# EasyEDA Pro project 多功能拓展板.eprj

# Schematic Schematic1
Create Date: 2024-04-21; Page Name: P1; Project Name: 多功能拓展板; Schematic Name: Schematic1; Update Date: 2024-04-21; Company: 嘉立创EDA; Page Size: A3; Version: V1.0
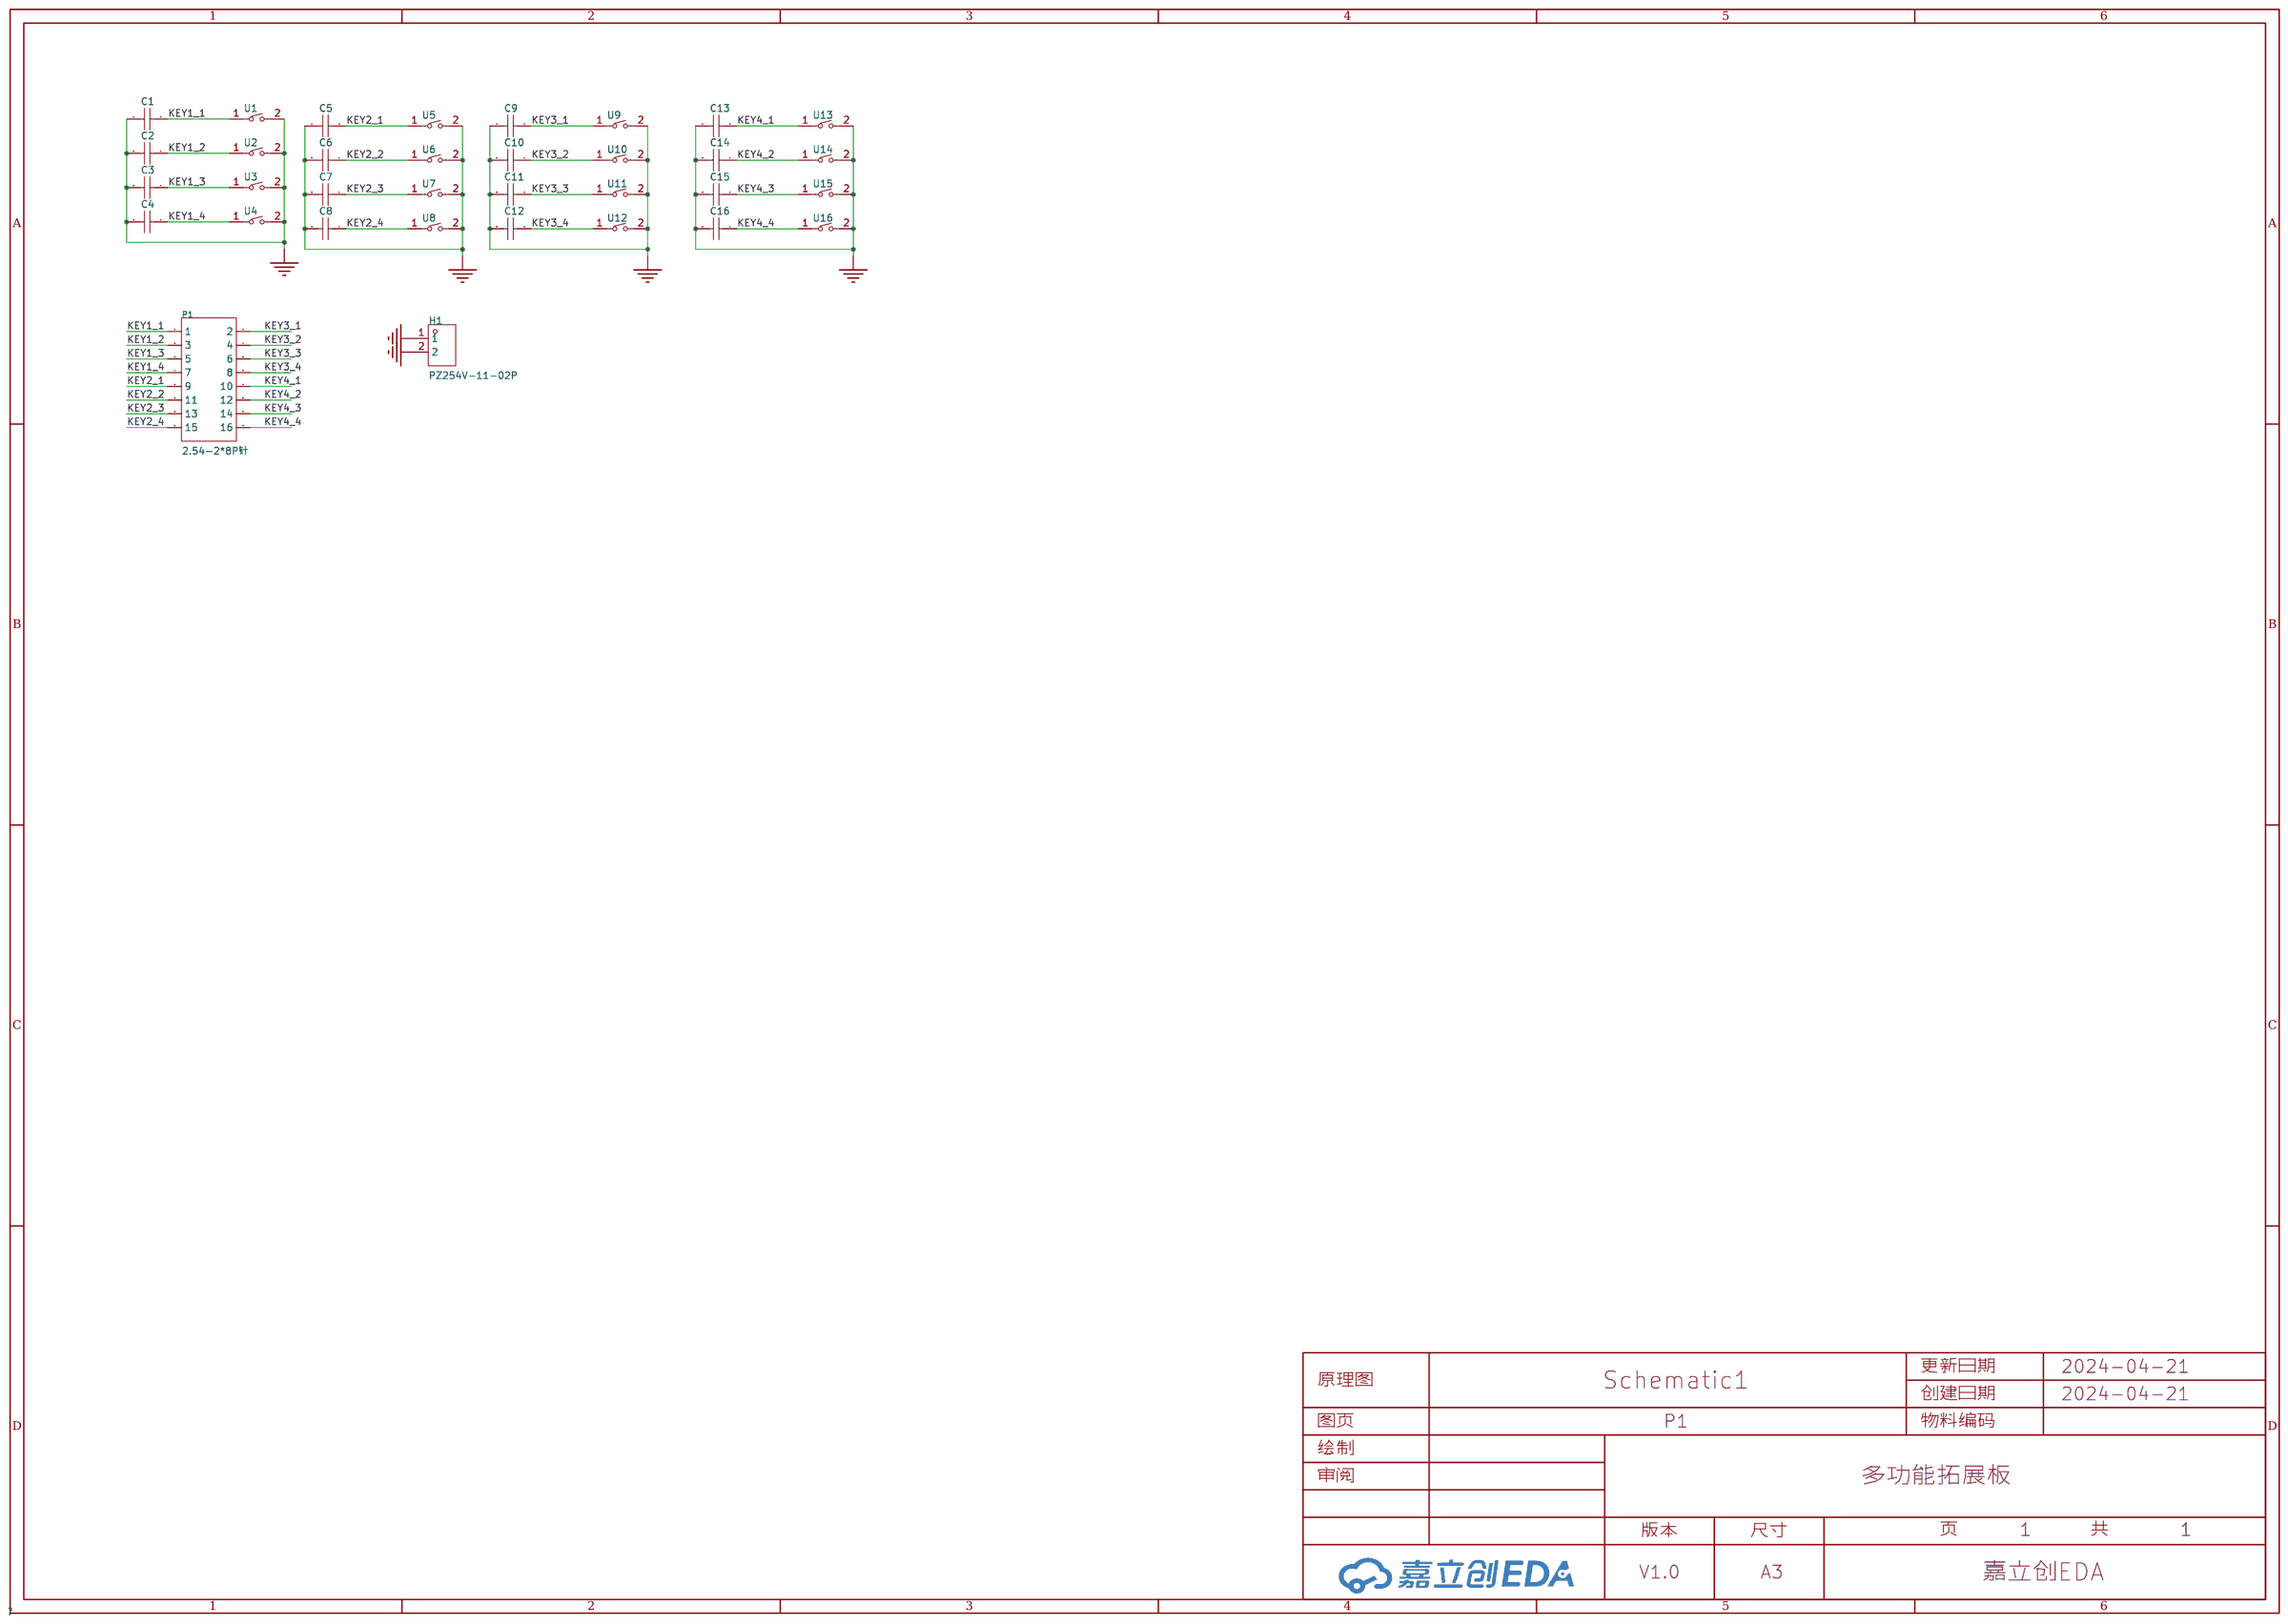
[diagram p0: schematic sheet]

## Parts
C1  100nF  [C0805]
C2  100nF  [C0805]
C3  100nF  [C0805]
C4  100nF  [C0805]
C5  100nF  [C0805]
C6  100nF  [C0805]
C7  100nF  [C0805]
C8  100nF  [C0805]
C9  100nF  [C0805]
C10  100nF  [C0805]
C11  100nF  [C0805]
C12  100nF  [C0805]
C13  100nF  [C0805]
C14  100nF  [C0805]
C15  100nF  [C0805]
C16  100nF  [C0805]
H1  PZ254V-11-02P  [HDR-TH_2P-P2.54-V-M]
P1  2.54-2*8P针  [HDR-TH_16P-P2.54-V-M-R2-C8-S2.54]
U1  ZX-QC36-4.3CJ  [KEY-TH_L6.0-W3.5-P6.50]
U2  ZX-QC36-4.3CJ  [KEY-TH_L6.0-W3.5-P6.50]
U3  ZX-QC36-4.3CJ  [KEY-TH_L6.0-W3.5-P6.50]
U4  ZX-QC36-4.3CJ  [KEY-TH_L6.0-W3.5-P6.50]
U5  ZX-QC36-4.3CJ  [KEY-TH_L6.0-W3.5-P6.50]
U6  ZX-QC36-4.3CJ  [KEY-TH_L6.0-W3.5-P6.50]
U7  ZX-QC36-4.3CJ  [KEY-TH_L6.0-W3.5-P6.50]
U8  ZX-QC36-4.3CJ  [KEY-TH_L6.0-W3.5-P6.50]
U9  ZX-QC36-4.3CJ  [KEY-TH_L6.0-W3.5-P6.50]
U10  ZX-QC36-4.3CJ  [KEY-TH_L6.0-W3.5-P6.50]
U11  ZX-QC36-4.3CJ  [KEY-TH_L6.0-W3.5-P6.50]
U12  ZX-QC36-4.3CJ  [KEY-TH_L6.0-W3.5-P6.50]
U13  ZX-QC36-4.3CJ  [KEY-TH_L6.0-W3.5-P6.50]
U14  ZX-QC36-4.3CJ  [KEY-TH_L6.0-W3.5-P6.50]
U15  ZX-QC36-4.3CJ  [KEY-TH_L6.0-W3.5-P6.50]
U16  ZX-QC36-4.3CJ  [KEY-TH_L6.0-W3.5-P6.50]

## Library data of the parts
C1-C16 = 0805B104K500NT: 容值:100nF;精度:±10%;额定电压:50V;材质(温度系数):X7R;; LCSC Part Name: 100nF ±10% 50V; Supplier Part: C38141; Manufacturer: FH(风华); Supplier Footprint: 0805; JLCPCB Part Class: 扩展库; Datasheet: https://atta.szlcsc.com/upload/public/pdf/source/20200305/C486355_26A10D38EF8C2A5C37091D0039909270.pdf; Supplier: LCSC; Tolerance: ±10%; Voltage Rated: 50V; Temperature Coefficient: X7R
H1 = PZ254V-11-02P: 插针结构:1x2P;间距:2.54mm;行距:-;圆针/方针:方针;安装类型:直插;排数:单排;总PIN位数:2P;额定电流:-;额定电压:-;配合针长度:6mm;塑高:2.5mm;端接针长度:3mm;触头材质:黄铜;触头镀层:-;工作温度范围:-40℃~+105℃;颜色:黑色;; LCSC Part Name: 间距:2.54mm 1x2P 直插 方针; Supplier Part: C492401; Manufacturer: XFCN(兴飞); Supplier Footprint: 插件,P=2.54mm; JLCPCB Part Class: Extended Part; Datasheet: https://atta.szlcsc.com/upload/public/pdf/source/20200309/C492401_A812433581A9B211A7FFA413ADDFF0E5.pdf; Supplier: LCSC; Pin Structure: 1x2P; Pitch: 2.54mm; Circluar Pins/Square Pins: 方针; Mounting Type: 直插; Number of Rows: 单排; Number of Pins: 2P; Length of Mating Pin: 6mm; Insulation Height: 2.5mm; Length of End Connection Pin: 3mm; Contact Material: 黄铜; Operating Temperature Range: -40℃~+105℃; Color: 黑色
P1 = 2.54-2*8P针_C68234: 插针结构:2x8P;间距:2.54mm;行距:2.54mm;圆针/方针:方针;安装类型:直插;排数:双排;总PIN位数:16P;额定电流:-;额定电压:-;配合针长度:5.9mm;塑高:2.54mm;端接针长度:-;触头材质:-;触头镀层:-;工作温度范围:-;焊接温度(最大值):-;颜色:黑色;; LCSC Part Name: 间距:2.54mm 2x8P 直插 方针; Supplier Part: C68234; Manufacturer: BOOMELE(博穆精密); Supplier Footprint: 插件,P=2.54mm; JLCPCB Part Class: 扩展库; Datasheet: https://atta.szlcsc.com/upload/public/pdf/source/20221201/C605E3BE9C0F7226363017EFD1BDE852.pdf; Supplier: LCSC; Pin Structure: 2x8P; Pitch: 2.54mm; Row Spacing: 2.54mm; Circluar Pins/Square Pins: 方针; Mounting Type: 直插; Number of Rows: 双排; Number of Pins: 16P; Length of Mating Pin: 5.9mm; Insulation Height: 2.54mm; Color: 黑色
U1 = ZX-QC36-4.3CJ: 电路结构:单刀单掷;按钮形状:矩形按钮;作用力:260gf;安装方式:直插;开关长度:3mm;开关宽度:6mm;开关高度:4.3mm;带支架:不带;触点电流:50mA;额定电压(AC):250V;额定电压(DC):12V;绝缘电阻:100MΩ;机械寿命:10万次;; LCSC Part Name: _; Supplier Part: C7470223; Manufacturer: Megastar(兆星); Supplier Footprint: DIP; JLCPCB Part Class: 扩展库; Datasheet: https://atta.szlcsc.com/upload/public/pdf/source/20230724/E786959C53B2405F67FB2C8E5CC6989E.pdf; Supplier: LCSC; Circuit: 单刀单掷; Actuator Style: 矩形按钮; Operating Force: 260gf; Mounting Style: 直插; Switch Length: 3mm; Switch Width: 6mm; Switch Height: 4.3mm; Strike Gundam: 不带; Contact Current: 50mA; Voltage Rating (AC): 250V; Voltage Rating (DC): 12V; Insulation Resistance: 100MΩ; Actuator/Cap Color: 白色; Pin Style: PC引脚; Mechanical Life: 10万次; Operating Temperature: -30℃~+80℃
U2-U16 = ZX-QC36-4.3CJ: 电路结构:单刀单掷;按钮形状:矩形按钮;作用力:260gf;安装方式:直插;开关长度:3mm;开关宽度:6mm;开关高度:4.3mm;带支架:不带;触点电流:50mA;额定电压(AC):250V;额定电压(DC):12V;绝缘电阻:100MΩ;机械寿命:10万次;; LCSC Part Name: 3*6*4.3插件开关; Supplier Part: C7470223; Manufacturer: Megastar(兆星); Supplier Footprint: DIP; JLCPCB Part Class: 扩展库; Datasheet: https://atta.szlcsc.com/upload/public/pdf/source/20230724/E786959C53B2405F67FB2C8E5CC6989E.pdf; Supplier: LCSC; Circuit: 单刀单掷; Actuator Style: 矩形按钮; Operating Force: 260gf; Mounting Style: 直插; Switch Length: 3mm; Switch Width: 6mm; Switch Height: 4.3mm; Strike Gundam: 不带; Contact Current: 50mA; Voltage Rating (AC): 250V; Voltage Rating (DC): 12V; Insulation Resistance: 100MΩ; Actuator/Cap Color: 白色; Pin Style: PC引脚; Mechanical Life: 10万次; Operating Temperature: -30℃~+80℃

## Nets
GND: C1.1 C2.2 C3.2 C4.2 C5.1 C6.2 C7.2 C8.2 C9.1 C10.2 C11.2 C12.2 C13.1 C14.2 C15.2 C16.2 H1.1 H1.2 U1.2 U2.2 U3.2 U4.2 U5.2 U6.2 U7.2 U8.2 U9.2 U10.2 U11.2 U12.2 U13.2 U14.2 U15.2 U16.2
KEY1_1: C1.2 P1.1 U1.1
KEY1_2: C2.1 P1.3 U2.1
KEY1_3: C3.1 P1.5 U3.1
KEY1_4: C4.1 P1.7 U4.1
KEY2_1: C5.2 P1.9 U5.1
KEY2_2: C6.1 P1.11 U6.1
KEY2_3: C7.1 P1.13 U7.1
KEY2_4: C8.1 P1.15 U8.1
KEY3_1: C9.2 P1.2 U9.1
KEY3_2: C10.1 P1.4 U10.1
KEY3_3: C11.1 P1.6 U11.1
KEY3_4: C12.1 P1.8 U12.1
KEY4_1: C13.2 P1.10 U13.1
KEY4_2: C14.1 P1.12 U14.1
KEY4_3: C15.1 P1.14 U15.1
KEY4_4: C16.1 P1.16 U16.1

# Board PCB1
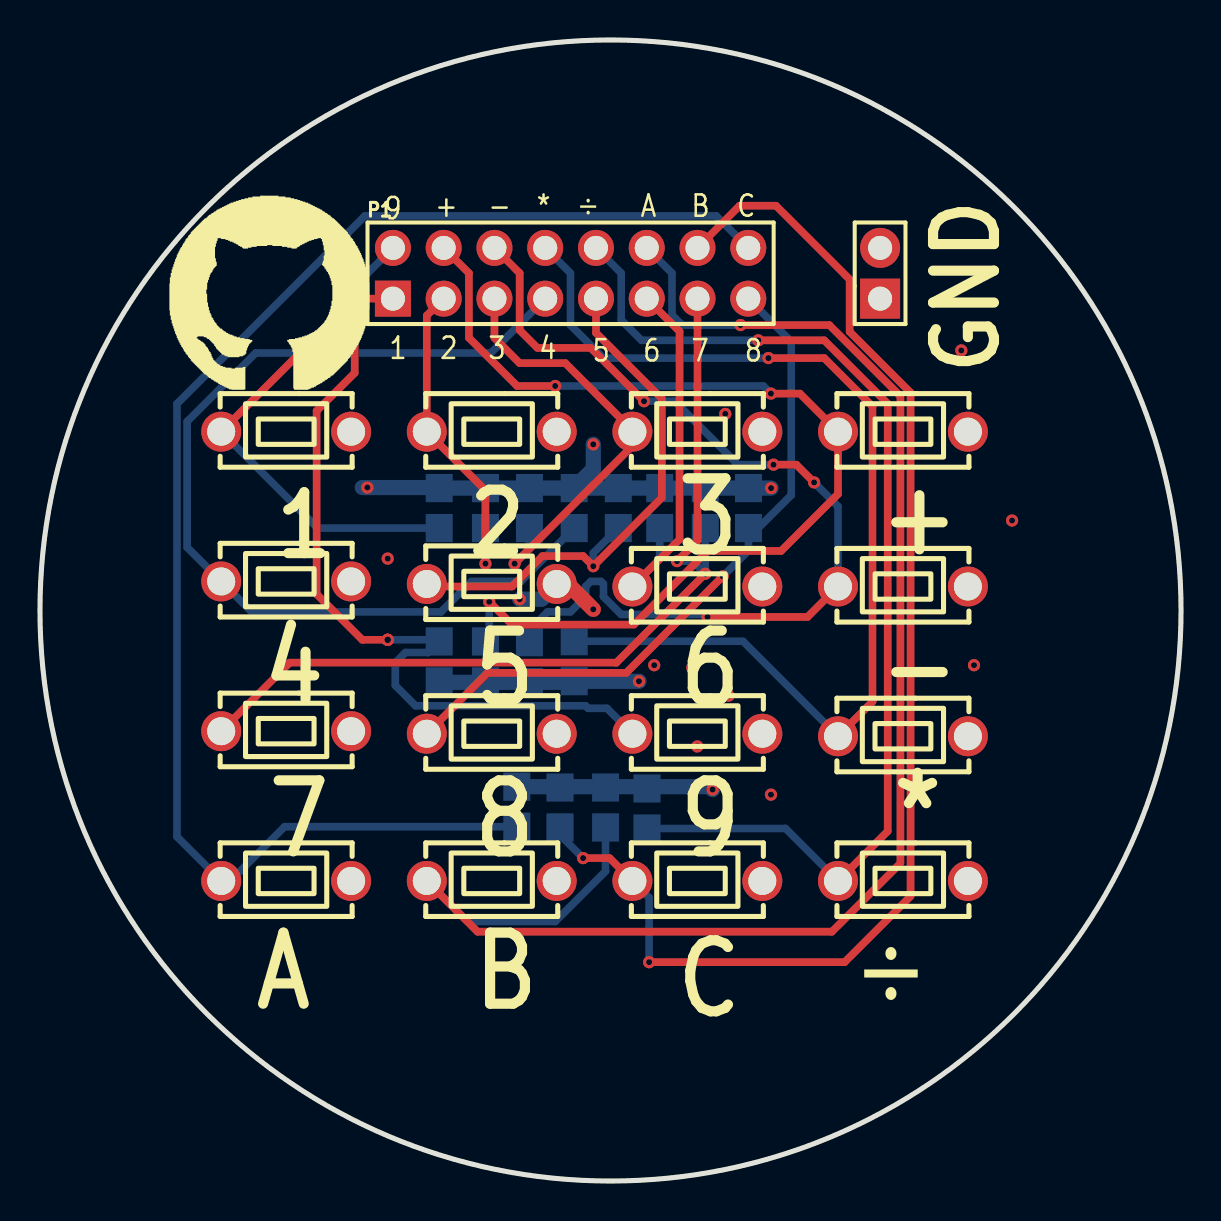
[diagram p1: board, top side]
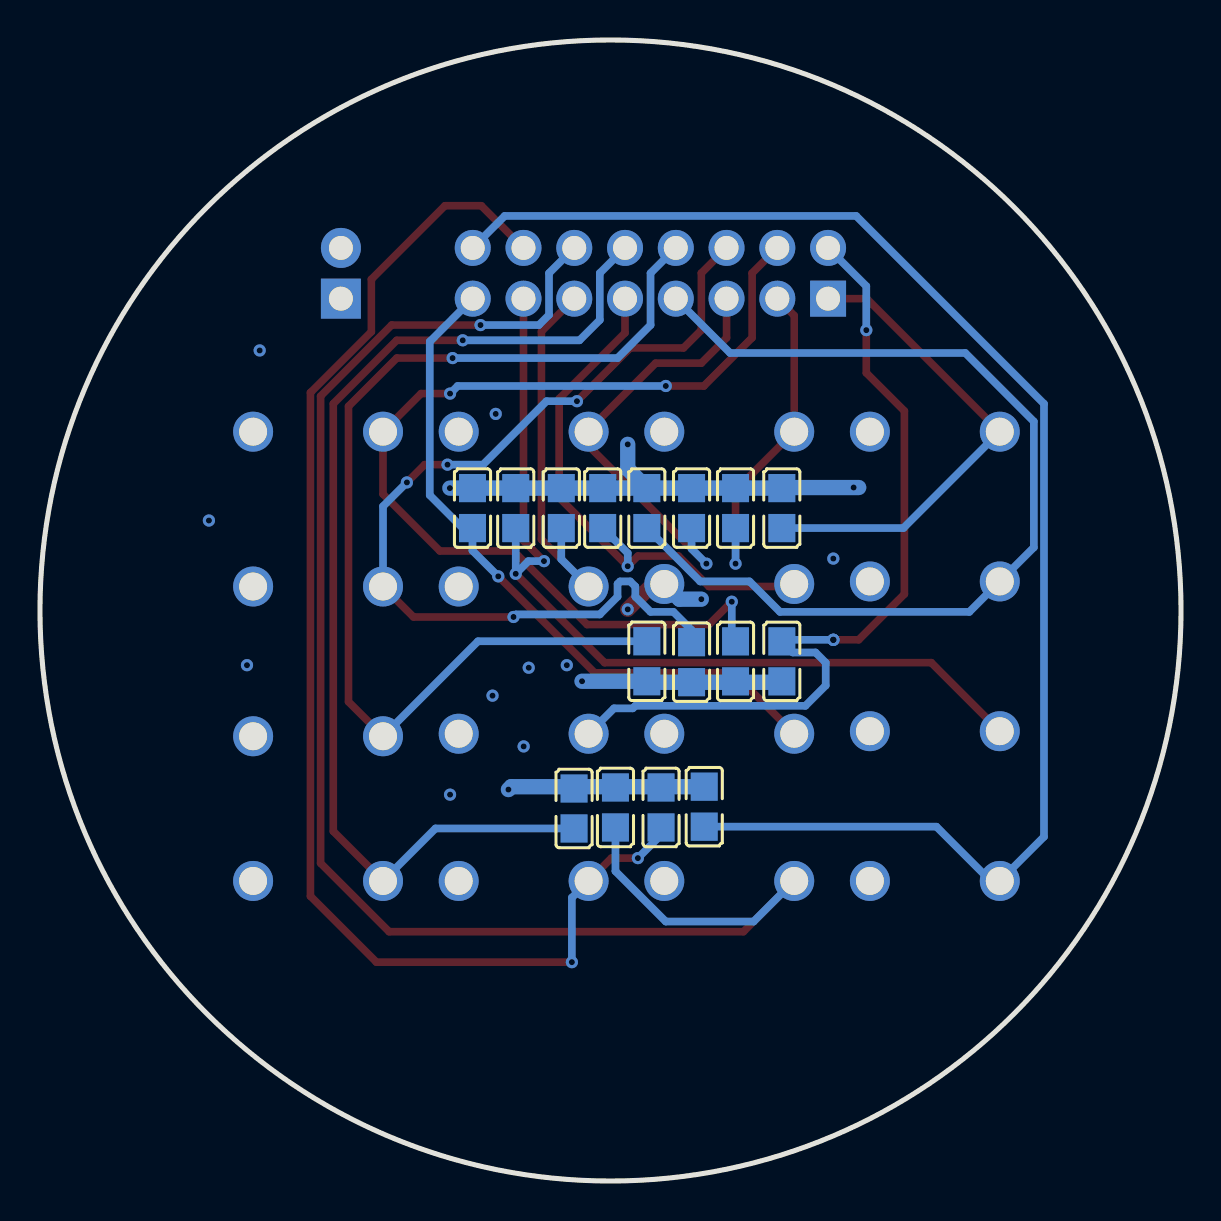
[diagram p2: board, bottom side, seen from below]

Outline 57.09 x 57.09 mm; copper layers: Top Layer, Bottom Layer. Coordinates in mm from the lower left corner of the outline.
Outline path: circle c28.55,28.55 r28.55
Stack: Top Layer 0.035mm / Dielectric1 1.51mm FR4 er 4.5 / Bottom Layer 0.035mm

## Design rules (mm)
template: 自定义配置
spacing copperThickness1oz (default): track to track 0.102, other pairs 0.152 to 0.3
spacing copperThickness2oz: track to track 0.203, other pairs 0.152 to 0.3
track width copperThickness1oz (default): min 0.127, default 0.254, max 2.54
track width copperThickness2oz: min 0.203, default 0.254, max 2.54
differential pair differentialPair (default): width min 0.127, default 0.254, max 2.54; gap min 0.152, default 0.152
via viaSize (default): diameter min 0.5, default 0.61, max 10; hole min 0.3, default 0.305, max 6.3

## Placement (name value [footprint] x y rotation side)
1  ZX-QC36-4.3CJ  [KEY-TH_L6.0-W3.5-P6.50]  12.32 37.49 0 top
2  ZX-QC36-4.3CJ  [KEY-TH_L6.0-W3.5-P6.50]  22.6 37.49 0 top
C1  100nF  [C0805]  19.97 33.67 270 bottom
C2  100nF  [C0805]  22.29 33.67 90 bottom
C3  100nF  [C0805]  24.49 33.67 90 bottom
C4  100nF  [C0805]  26.73 33.67 90 bottom
C5  100nF  [C0805]  28.94 33.67 270 bottom
C6  100nF  [C0805]  31.01 33.67 90 bottom
C7  100nF  [C0805]  33.29 33.67 90 bottom
C8  100nF  [C0805]  35.45 33.67 90 bottom
C9  100nF  [C0805]  19.97 26 90 bottom
C10  100nF  [C0805]  22.29 26 270 bottom
C11  100nF  [C0805]  24.49 25.96 270 bottom
C12  100nF  [C0805]  26.73 26.01 270 bottom
C13  100nF  [C0805]  30.37 18.64 270 bottom
C14  100nF  [C0805]  28.3 18.69 90 bottom
C15  100nF  [C0805]  26.02 18.69 90 bottom
C16  100nF  [C0805]  23.86 18.73 90 bottom
GND  PZ254V-11-02P  [HDR-TH_2P-P2.54-V-M]  42.04 45.42 90 top
P1  2.54-2*8P针  [HDR-TH_16P-P2.54-V-M-R2-C8-S2.54]  26.55 45.42 0 top
U3  ZX-QC36-4.3CJ  [KEY-TH_L6.0-W3.5-P6.50]  32.89 37.49 0 top
U4  ZX-QC36-4.3CJ  [KEY-TH_L6.0-W3.5-P6.50]  12.32 30 0 top
U5  ZX-QC36-4.3CJ  [KEY-TH_L6.0-W3.5-P6.50]  22.6 29.87 0 top
U6  ZX-QC36-4.3CJ  [KEY-TH_L6.0-W3.5-P6.50]  32.89 29.75 0 top
U7  ZX-QC36-4.3CJ  [KEY-TH_L6.0-W3.5-P6.50]  12.32 22.51 0 top
U8  ZX-QC36-4.3CJ  [KEY-TH_L6.0-W3.5-P6.50]  22.6 22.38 0 top
U9  ZX-QC36-4.3CJ  [KEY-TH_L6.0-W3.5-P6.50]  32.89 22.38 0 top
U10  ZX-QC36-4.3CJ  [KEY-TH_L6.0-W3.5-P6.50]  43.18 37.49 0 top
U11  ZX-QC36-4.3CJ  [KEY-TH_L6.0-W3.5-P6.50]  43.18 29.75 0 top
U12  ZX-QC36-4.3CJ  [KEY-TH_L6.0-W3.5-P6.50]  43.18 22.25 0 top
U13  ZX-QC36-4.3CJ  [KEY-TH_L6.0-W3.5-P6.50]  43.18 15.02 0 top
U14  ZX-QC36-4.3CJ  [KEY-TH_L6.0-W3.5-P6.50]  22.6 15.02 0 top
U15  ZX-QC36-4.3CJ  [KEY-TH_L6.0-W3.5-P6.50]  32.89 15.02 0 top
U16  ZX-QC36-4.3CJ  [KEY-TH_L6.0-W3.5-P6.50]  12.32 15.02 0 top

## Footprints (pads in the part's own frame, mm; a bottom-side part is the same pattern mirrored in y, then rotated)
C0805
  rect 1.41x1.35 smd: 1(-1,0) 2(1,0)
HDR-TH_2P-P2.54-V-M
  rect 2x2 hole 1.2: 1(-1.27,0)
  round 2 hole 1.2: 2(1.27,0)
HDR-TH_16P-P2.54-V-M-R2-C8-S2.54
  rect 1.8x1.8 hole 1.2: 1(-8.89,-1.27)
  round 1.8 hole 1.2: 2(-8.89,1.27) 3(-6.35,-1.27) 4(-6.35,1.27) 5(-3.81,-1.27) 6(-3.81,1.27) 7(-1.27,-1.27) 8(-1.27,1.27) 9(1.27,-1.27) 10(1.27,1.27) 11(3.81,-1.27) 12(3.81,1.27) 13(6.35,-1.27) 14(6.35,1.27) 15(8.89,-1.27) 16(8.89,1.27)
KEY-TH_L6.0-W3.5-P6.50
  round 2 hole 1.4: 1(-3.25,0) 2(3.25,0)

## Nets
As in the schematic, except:
GND: 1.2 2.2 C1.1 C2.2 C3.2 C4.2 C5.1 C6.2 C7.2 C8.2 C9.1 C10.2 C11.2 C12.2 C13.1 C14.2 C15.2 C16.2 GND.1 GND.2 U3.2 U4.2 U5.2 U6.2 U7.2 U8.2 U9.2 U10.2 U11.2 U12.2 U13.2 U14.2 U15.2 U16.2
KEY1_1: 1.1 C1.2 P1.1
KEY1_2: 2.1 C2.1 P1.3

## Via types
v1: diameter 0.61, hole 0.305, Top Layer to Bottom Layer, 39 vias

## Routing (per net, layer and track width the routed paths; a pad name or vN(x,y) marks a point on that pad's centre or on a via; arc(x,y) is an arc through that point)
GND: length 47.4
  Top Layer w0.762: v1(27.68,28.6) 26.41,29.87 U5.2
  Bottom Layer w0.762: 16.13,34.7 19.94,34.7 19.97,34.67 C8.2 v1(36.58,34.67) ; 19.99,24.95 26.67,24.95 C12.2 v1(29.97,25.01) ; C16.2 33.51,19.73 v1(33.65,19.59) ; v1(24,29.11) 25.09,29.11 U5.2 ; C4.2 27.68,35.63 v1(27.68,36.86)
  vias: v1(16.38,34.7) v1(17.4,31.14) v1(30.73,25.81) v1(32.64,25.68) v1(32.89,21.75) v1(34.29,38.38) v1(34.45,24.29) v1(36.57,19.33) v1(46.1,41.56) v1(46.73,25.81) v1(48.64,33.05)
KEY1_1: length 24.3
  Top Layer w0.381: P1.1 15.72,44.15 1.1
  Bottom Layer w0.381: 1.1 13.89,32.67 C1.2
KEY1_2: length 16.6
  Top Layer w0.381: P1.3 19.35,43.3 2.1 22.29,34.56 v1(22.29,30.89)
  Bottom Layer w0.381: C2.1 v1(22.29,30.89)
KEY1_3: length 22
  Top Layer w0.381: P1.5 22.74,42.19 24,40.92 26.29,40.92 29.64,37.57 U3.1 29.64,36.78 v1(23.75,30.89)
  Bottom Layer w0.381: v1(23.75,30.89) 24.49,31.63 C3.1
KEY1_4: length 49.2
  Bottom Layer w0.381: C4.1 24.06,30 21.59,30 20.06,28.48 10.59,28.48 U4.1 7.36,31.7 7.36,38 10.79,41.43 22.56,41.43 P1.7
KEY2_1: length 27.8
  Top Layer w0.381: P1.9 27.82,42.44 31.11,39.15 31.11,34.19 v1(27.68,30.76) 27.18,31.27 25.14,31.27 23.62,29.75 19.48,29.75 U5.1
  Bottom Layer w0.381: C5.2 27.68,31.42 v1(27.68,30.76)
KEY2_2: length 19.6
  Top Layer w0.381: P1.11 32,42.51 32,32.11 U6.1
  Bottom Layer w0.381: U6.1 31.01,31.11 C6.1
KEY2_3: length 45
  Top Layer w0.381: v1(31.88,31.02) 32.9,32.04 P1.13 ; U7.1 12.5,25.94 28.84,25.94 v1(33.29,30.38)
  Bottom Layer w0.381: v1(31.88,31.02) 32.65,31.02 v1(33.29,30.38) C7.1
KEY2_4: length 34.6
  Top Layer w0.381: v1(34.16,30.26) 29.34,25.43 22.4,25.43 U8.1
  Bottom Layer w0.381: v1(34.16,30.26) 35.45,31.54 C8.1 35.94,32.67 37.59,34.32 37.59,42 P1.15
KEY3_1: length 42.7
  Top Layer w0.381: v1(17.4,27.08) 16.13,27.08 13.84,29.37 13.84,38.53 15.75,40.44 v1(15.75,42.57)
  Bottom Layer w0.381: v1(17.4,27.08) 19.9,27.08 C9.2 19.42,26.45 18.29,26.45 17.78,25.94 17.78,24.79 18.79,23.78 27.3,23.78 27.43,23.65 28.37,23.65 U9.1 ; P1.2 15.75,44.78 v1(15.75,42.57)
KEY3_2: length 51.8
  Top Layer w0.381: 39.37,37.49 U10.1 ; U10.1 39.93,34.37 37.08,31.53 33.4,31.53 29.72,27.84 23.62,27.84 v1(22.48,28.99) ; U10.1 38.02,39.4 v1(36.57,39.4) ; v1(25.78,39.78) 23.87,39.78 21.46,42.19 21.46,45.43 P1.4
  Bottom Layer w0.381: C10.1 22.48,27.19 v1(22.48,28.99) ; v1(25.78,39.78) 36.19,39.78 v1(36.57,39.4)
KEY3_3: length 47.3
  Top Layer w0.381: v1(30.22,39.02) 27.56,41.69 24.89,41.69 24,42.57 24,45.43 P1.6 ; v1(38.73,34.95) 37.84,35.84 v1(36.7,35.84) ; v1(33.4,28.22) 38.4,28.22 U11.1
  Bottom Layer w0.381: v1(33.4,28.22) 33.27,28.35 29.08,28.35 28.19,29.24 28.19,29.87 28.07,30 27.56,30 27.3,29.75 27.3,29.24 26.54,28.48 25.4,28.48 24.49,27.57 C11.1 ; v1(36.7,35.84) 34.92,35.84 31.75,39.02 v1(30.22,39.02) ; U11.1 39.93,33.76 v1(38.73,34.95)
KEY3_4: length 53.6
  Top Layer w0.381: v1(36.45,41.18) 39.24,41.18 41.65,38.76 41.65,23.98 U12.1
  Bottom Layer w0.381: U12.1 35.18,27.01 C12.1 ; v1(36.45,41.18) 28.19,41.18 26.54,42.83 26.54,45.43 P1.8
KEY4_1: length 54.8
  Top Layer w0.381: U13.1 42.42,17.5 42.42,38.89 39.24,42.07 v1(35.94,42.07)
  Bottom Layer w0.381: P1.10 29.08,45.43 29.08,43.08 30.1,42.07 v1(35.94,42.07) ; C13.2 37.3,17.64 U13.1
KEY4_2: length 79.5
  Top Layer w0.381: v1(35.05,42.83) 39.5,42.83 43.05,39.27 43.05,15.9 39.62,12.48 21.89,12.48 U14.1
  Bottom Layer w0.381: C14.1 28.3,15.5 25.78,12.98 21.39,12.98 U14.1 ; v1(35.05,42.83) 32.13,42.83 31.62,43.34 31.62,45.43 P1.12
KEY4_3: length 65.9
  Top Layer w0.381: v1(30.48,10.95) 40.26,10.95 43.56,14.25 43.56,39.45 40.51,42.5 40.51,45.11 36.83,48.8 35.01,48.8 P1.14 ; v1(27.18,16.16) 28.5,16.16 U15.1
  Bottom Layer w0.381: v1(30.48,10.95) 30.48,14.18 U15.1 ; v1(27.18,16.16) 26.02,17.32 C15.1
KEY4_4: length 73.8
  Bottom Layer w0.381: C16.1 12.24,17.73 9.52,15.02 U16.1 6.86,17.23 6.86,38.89 16.25,48.29 33.84,48.29 P1.16

## Copper pours and planes (outline as drawn; the poured copper is in the pictures)
GND on Top Layer: 57.43,28.99 57.39,30.03 57.32,31.06 57.2,32.09 57.06,33.12 56.87,34.14 56.65,35.15 56.4,36.15 56.1,37.15 55.78,38.13 55.42,39.1 55.02,40.06 54.59,41 54.13,41.93 53.63,42.83 53.1,43.72 52.54,44.6 51.95,45.45 51.33,46.28 50.68,47.08 50,47.87 49.3,48.62 48.56,49.36 47.8,50.06 47.02,50.74 46.22,51.39 45.39,52.01 44.54,52.6 43.66,53.16 42.77,53.69 41.86,54.19 40.94,54.65 40,55.08 39.04,55.48 38.07,55.84 37.09,56.17 36.09,56.46 35.09,56.71 34.08,56.93 33.06,57.12 32.03,57.26 31,57.38 29.97,57.45 28.93,57.49 27.9,57.49 26.86,57.45 25.83,57.38 24.8,57.26 23.78,57.12 22.76,56.93 21.74,56.71 20.74,56.46 19.75,56.17 18.76,55.84 17.79,55.48 16.84,55.08 15.89,54.65 14.97,54.19 14.06,53.69 13.17,53.16 12.3,52.6 11.45,52.01 10.62,51.39 9.81,50.74 9.03,50.06 8.27,49.36 7.54,48.62 6.83,47.87 6.15,47.08 5.5,46.28 4.88,45.45 4.29,44.6 3.73,43.72 3.2,42.83 2.71,41.93 2.24,41 1.81,40.06 1.42,39.1 1.06,38.13 0.73,37.15 0.44,36.15 0.18,35.15 -0.04,34.14 -0.22,33.12 -0.37,32.09 -0.48,31.06 -0.56,30.03 -0.59,28.99 -0.59,27.96 -0.56,26.92 -0.48,25.89 -0.37,24.86 -0.22,23.84 -0.04,22.82 0.18,21.8 0.44,20.8 0.73,19.81 1.06,18.82 1.42,17.85 1.81,16.9 2.24,15.95 2.71,15.03 3.2,14.12 3.73,13.23 4.29,12.36 4.88,11.51 5.5,10.68 6.15,9.87 6.83,9.09 7.54,8.33 8.27,7.6 9.03,6.89 9.81,6.21 10.62,5.56 11.45,4.94 12.3,4.35 13.17,3.79 14.06,3.26 14.97,2.77 15.89,2.3 16.84,1.87 17.79,1.48 18.76,1.12 19.75,0.79 20.74,0.5 21.74,0.24 22.76,0.02 23.78,-0.16 24.8,-0.31 25.83,-0.42 26.86,-0.5 27.9,-0.53 28.93,-0.53 29.97,-0.5 31,-0.42 32.03,-0.31 33.06,-0.16 34.08,0.02 35.09,0.24 36.09,0.5 37.09,0.79 38.07,1.12 39.04,1.48 40,1.87 40.94,2.3 41.86,2.77 42.77,3.26 43.66,3.79 44.54,4.35 45.39,4.94 46.22,5.56 47.02,6.21 47.8,6.89 48.56,7.6 49.3,8.33 50,9.09 50.68,9.87 51.33,10.68 51.95,11.51 52.54,12.36 53.1,13.23 53.63,14.12 54.13,15.03 54.59,15.95 55.02,16.9 55.42,17.85 55.78,18.82 56.1,19.81 56.4,20.8 56.65,21.8 56.87,22.82 57.06,23.84 57.2,24.86 57.32,25.89 57.39,26.92 57.43,27.96
GND on Bottom Layer: 57.54,29.15 57.5,30.18 57.43,31.21 57.32,32.24 57.17,33.27 56.99,34.29 56.77,35.3 56.51,36.3 56.22,37.3 55.89,38.28 55.53,39.25 55.13,40.21 54.7,41.15 54.24,42.08 53.74,42.99 53.21,43.88 52.65,44.75 52.06,45.6 51.44,46.43 50.79,47.23 50.11,48.02 49.41,48.77 48.68,49.51 47.92,50.21 47.14,50.89 46.33,51.54 45.5,52.16 44.65,52.75 43.78,53.31 42.89,53.84 41.98,54.34 41.05,54.8 40.11,55.23 39.15,55.63 38.18,55.99 37.2,56.32 36.21,56.61 35.2,56.86 34.19,57.08 33.17,57.27 32.15,57.42 31.12,57.53 30.08,57.6 29.05,57.64 28.01,57.64 26.98,57.6 25.94,57.53 24.91,57.42 23.89,57.27 22.87,57.08 21.86,56.86 20.85,56.61 19.86,56.32 18.88,55.99 17.91,55.63 16.95,55.23 16.01,54.8 15.08,54.34 14.17,53.84 13.28,53.31 12.41,52.75 11.56,52.16 10.73,51.54 9.92,50.89 9.14,50.21 8.38,49.51 7.65,48.77 6.94,48.02 6.27,47.23 5.62,46.43 5,45.6 4.41,44.75 3.85,43.88 3.32,42.99 2.82,42.08 2.36,41.15 1.93,40.21 1.53,39.25 1.17,38.28 0.84,37.3 0.55,36.3 0.29,35.3 0.07,34.29 -0.11,33.27 -0.26,32.24 -0.37,31.21 -0.44,30.18 -0.48,29.15 -0.48,28.11 -0.44,27.08 -0.37,26.04 -0.26,25.01 -0.11,23.99 0.07,22.97 0.29,21.96 0.55,20.95 0.84,19.96 1.17,18.98 1.53,18.01 1.93,17.05 2.36,16.11 2.82,15.18 3.32,14.27 3.85,13.38 4.41,12.51 5,11.66 5.62,10.83 6.27,10.02 6.94,9.24 7.65,8.48 8.38,7.75 9.14,7.04 9.92,6.37 10.73,5.72 11.56,5.09 12.41,4.5 13.28,3.94 14.17,3.42 15.08,2.92 16.01,2.46 16.95,2.03 17.91,1.63 18.88,1.27 19.86,0.94 20.85,0.65 21.86,0.39 22.87,0.17 23.89,-0.01 24.91,-0.16 25.94,-0.27 26.98,-0.34 28.01,-0.38 29.05,-0.38 30.08,-0.34 31.12,-0.27 32.15,-0.16 33.17,-0.01 34.19,0.17 35.2,0.39 36.21,0.65 37.2,0.94 38.18,1.27 39.15,1.63 40.11,2.03 41.05,2.46 41.98,2.92 42.89,3.42 43.78,3.94 44.65,4.5 45.5,5.09 46.33,5.72 47.14,6.37 47.92,7.04 48.68,7.75 49.41,8.48 50.11,9.24 50.79,10.02 51.44,10.83 52.06,11.66 52.65,12.51 53.21,13.38 53.74,14.27 54.24,15.18 54.7,16.11 55.13,17.05 55.53,18.01 55.89,18.98 56.22,19.96 56.51,20.95 56.77,21.96 56.99,22.97 57.17,23.99 57.32,25.01 57.43,26.04 57.5,27.08 57.54,28.11

## Text on the board
Top Silkscreen Layer: 9 | 1 | + | 2 | - | 3 | * | 4 | 5 | A | 6 | B | 7 | C | 8 | ÷
